# Altium schematic sheet APPS.SchDoc
size A4; SheetNumber: 4; SheetTotal: 6
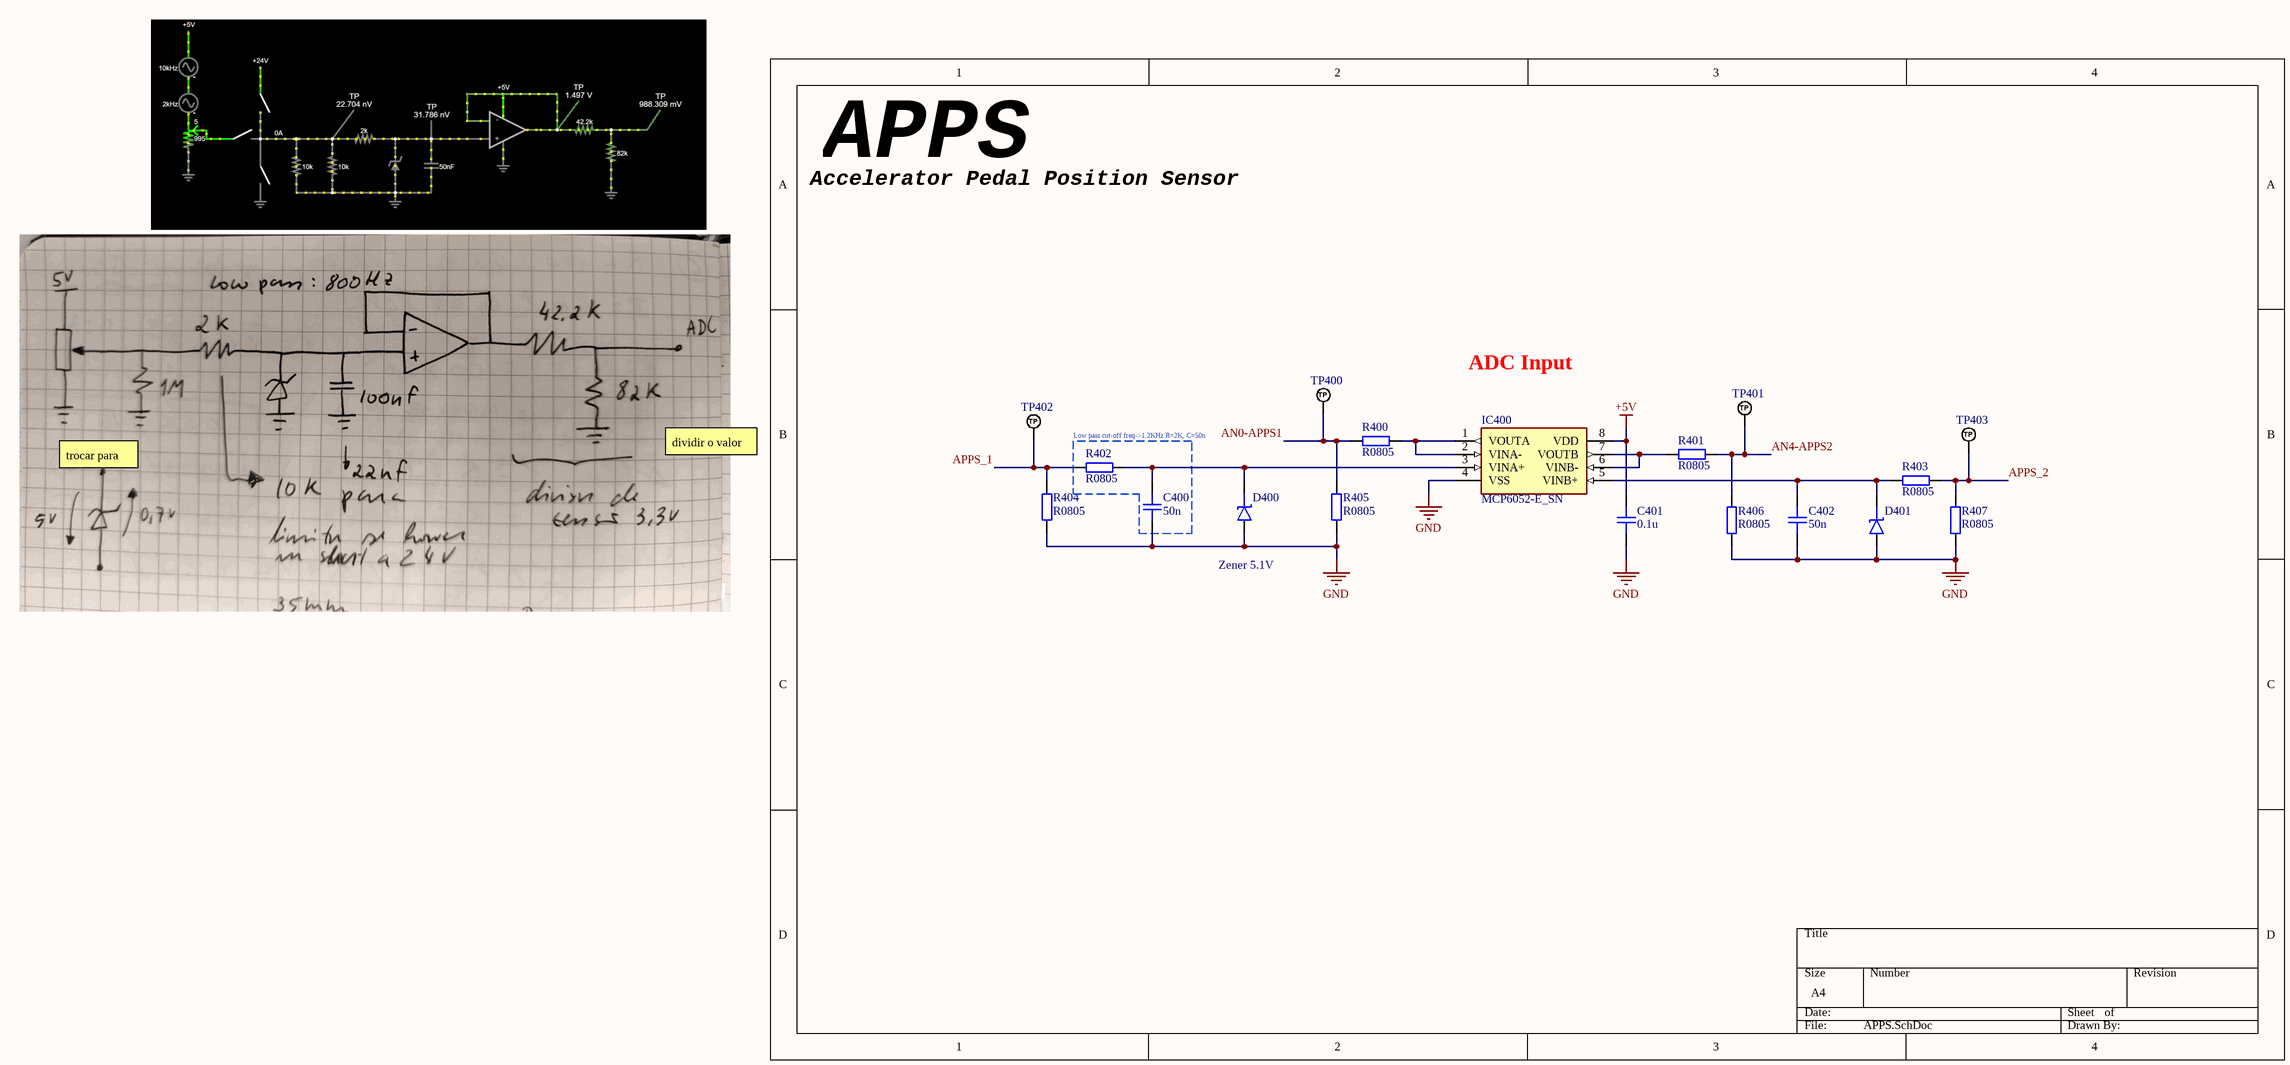
[diagram p0: APPS.SchDoc]

## Parts
C400  50n  [CAP_0805]
C401  0.1u  [CAP_0805]
C402  50n  [CAP_0805]
D400  D_SCHOTTKY_SOD_323  [SOD-323]  (value not drawn)
D401  D_SCHOTTKY_SOD_323  [SOD-323]  (value not drawn)
IC400  MCP6052-E_SN  [SOIC127P600X175-8N]
R400  R0805  [RES_0805]
R401  R0805  [RES_0805]
R402  R0805  [RES_0805]
R403  R0805  [RES_0805]
R404  R0805  [RES_0805]
R405  R0805  [RES_0805]
R406  R0805  [RES_0805]
R407  R0805  [RES_0805]
TP400  TP_NOBOM  [PAD_RND_1MM]  (value not drawn)  (no BOM)
TP401  TP_NOBOM  [PAD_RND_1MM]  (value not drawn)  (no BOM)
TP402  TP_NOBOM  [PAD_RND_1MM]  (value not drawn)  (no BOM)
TP403  TP_NOBOM  [PAD_RND_1MM]  (value not drawn)  (no BOM)

## Blocks framed on the sheet
Low pass cut-off freq->1.2KHz R=2K, C=50n: C400 R402

## Nets
+5V: C401.2 IC400.8(VDD)
GND: C400.2 C401.1 C402.2 D400.A D401.A IC400.4(VSS) R404.1 R405.2 R406.2 R407.1
AN0-APPS1: R400.2 R405.1 TP400.1(TP)
AN4-APPS2: R401.1 R406.1 TP401.1(TP)
APPS_1: R402.1 R404.2 TP402.1(TP)
APPS_2: R403.2 R407.2 TP403.1(TP)
NetC400_1: C400.1 D400.K IC400.3(VINA+) R402.2
NetC402_1: C402.1 D401.K IC400.5(VINB+) R403.1
NetIC400_1: IC400.1(VOUTA) IC400.2(VINA-) R400.1
NetIC400_6: IC400.6(VINB-) IC400.7(VOUTB) R401.2

## Notes on the sheet
- Accelerator Pedal Position Sensor
- APPS
- ADC Input
- trocar para 100k
- dividir o valor das resistencias por 10
- (near D400) Zener 5.1V

## Library data of the parts
C400-C402 = CAP_0805_10V: Capacitor SMD 0805 10V
D400 D401 = D_SCHOTTKY_SOD_323: Diode Schottky SMD SOD-323
IC400 = MCP6052-E_SN: Integrated Circuit; Manufacturer_Name: Microchip; Manufacturer_Part_Number: MCP6052-E/SN; Datasheet Link: http://ww1.microchip.com/downloads/en/DeviceDoc/MCP6051_DS22182B.pdf; Height: 1.75mm; Mouser Part Number: 579-MCP6052-E/SN; Mouser Price/Stock: https://www.mouser.com/Search/Refine.aspx?Keyword=579-MCP6052-E%2FSN
R400-R407 = RES_0805: Resistor SMD 0805; Manufacturer: *; Manufacturer Part Number: *; Distributor Link: *; LCSC: *
TP400-TP403 = TEST_POINT_RND_1MM: Test Point Round 1mm (NO BOM)